# EAGLE schematic Board2 (EAGLE 9.6.2)
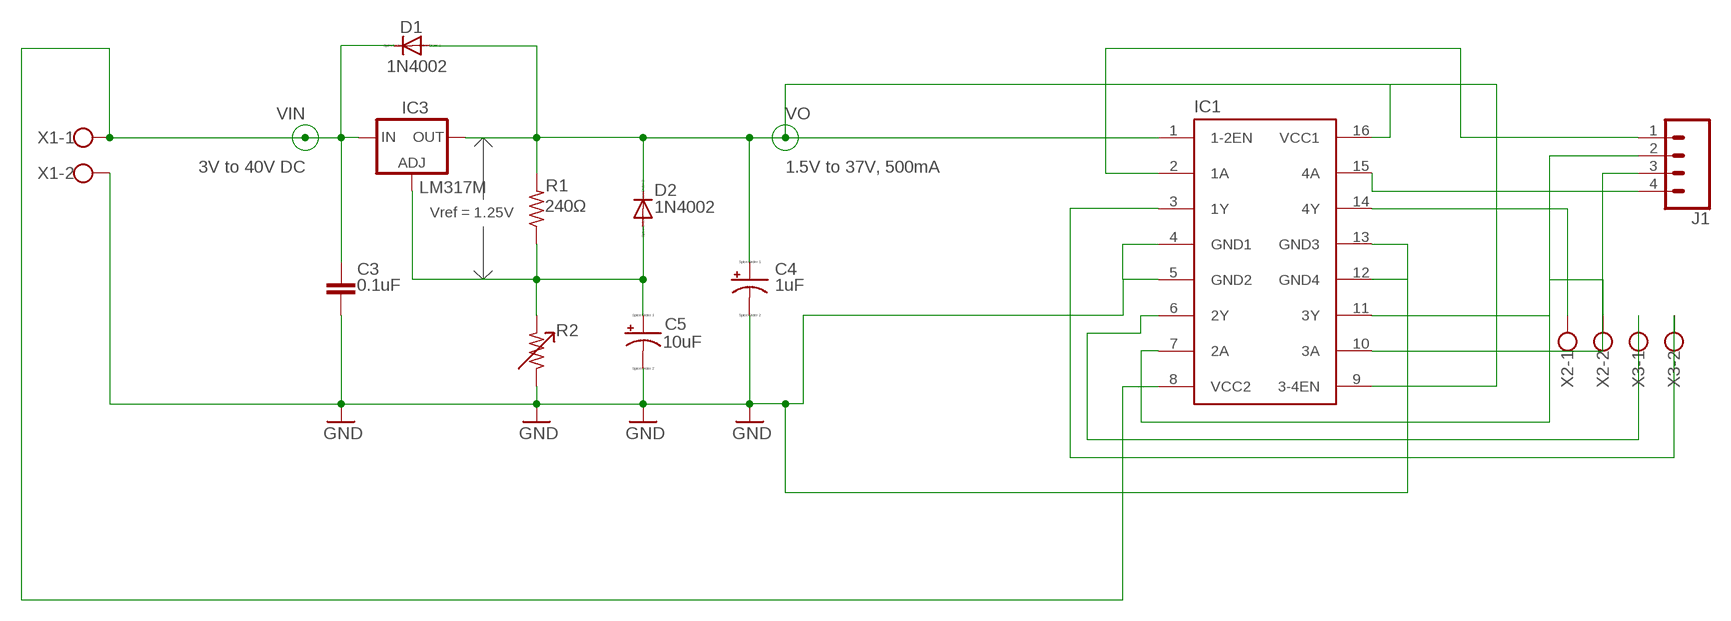
[diagram p0: schematic, sheet 1]

## Parts
C3  0.1uF  C-EU075-052X106  [C075-052X106]
C4  1uF  CPOL-US085CS-1AR  [085CS_1AR]
C5  10uF  CPOL-US085CS-1AR  [085CS_1AR]
D1  1N4002  1N4004  [DO41-10]
D2  1N4002  1N4004  [DO41-10]
IC1  L293D  [DIL16]
IC3  LM317MBSTT3  [SOT223]
J1  CONN_04PTH  [1X04]
R1  240Ω  R-US_M0805  [M0805]
R2  RESISTOR_TRIMR0805  [R0805]
X1  W237-102  [W237-102]
X2  W237-102  [W237-102]
X3  W237-102  [W237-102]

## Nets
GND: C3.2 C4.- C5.- IC1.4(GND1) IC1.5(GND2) IC1.12(GND4) IC1.13(GND3) R2.1 X1.2
N$1: C5.+ D2.A IC3.1(ADJ) R1.1 R2.2
N$2: IC1.15(4A) J1.4
N$3: IC1.10(3A) J1.3
N$4: IC1.14(4Y) X2.1
N$5: IC1.11(3Y) X2.2
N$6: IC1.3(1Y) X3.2
N$7: IC1.6(2Y) X3.1
N$8: IC1.7(2A) J1.2
N$9: IC1.2(1A) J1.1
VIN: C3.1 D1.C IC1.8(VCC2) IC3.3(IN) X1.1
VO: C4.+ D1.A D2.C IC1.1(1-2EN) IC1.9(3-4EN) IC1.16(VCC1) IC3.4(OUT) R1.2

## Notes on the sheet
- 3V to 40V DC | 1.5V to 37V, 500mA
- Vref = 1.25V

## Library data of the parts
C3 = rcl:C-EU: CAPACITOR, European symbol
C4 C5 = resistor:CPOL-US: POLARIZED CAPACITOR, American symbol
D1 D2 = diode:1N4004: DIODE general purpose rectifier, 1 A
IC1 = st-microelectronics:L293D: PUSH-PULL 4 CHANNEL DRIVER; MPN: L293D; OC_FARNELL: 9589619; OC_NEWARK: 56P8249
IC3 = v-reg:LM317?*: 500 mA Adjustable Output Positive Voltage Regulator Source: http://www.onsemi.co.jp .. LM317M-D.PDF; PARTNUMBER: LM317M
J1 = SparkFun-Connectors:CONN_04: Multi connection point. Often used as Generic Header-pin footprint for 0.1 inch spaced/style header connections On any of the 0.1 inch spaced packages, you can populate with these: Break Away Headers - Straight <https://www.sparkfun.com/products/116> (PRT-00116) Break Away Male Headers - Right Angle <https://www.sparkfun.com/products/553> (PRT-00553) Female Headers <https://www.sparkfun.com/products/115> (PRT-00115) Break Away Headers - Machine Pin <https://www.sparkfun.com/products/117> (PRT-00117) Break Away Female Headers - Swiss Machine Pin <https://www.sparkfun.com/products/743> (PRT-00743) For SCREWTERMINALS and SPRING TERMINALS visit here: Screw Terimnals on SparkFun.com <https://www.sparkfun.com/search/results?term=Screw+Terminals> (5mm/3.5mm/2.54mm spacing) This device is also useful as a general connection point to wire up your design to another part of your project. Our various solder wires solder well into these plated through hole pads. Hook-Up Wire - Assortment (Stranded, 22 AWG) <https://www.sparkfun.com/products/11375> (PRT-11375) Hook-Up Wire - Assortment (Solid Core, 22 AWG) <https://www.sparkfun.com/products/11367> (PRT-11367) View the entire wire category on our website here <https://www.sparkfun.com/categories/141> Special notes: Molex polarized connector foot print use with SKU : PRT-08231 with associated crimp pins and housings. 1MM SMD Version SKU: PRT-10208; PROD_ID: CONN-09696
R1 = resistor:R-US_: RESISTOR, American symbol
R2 = designblock:RESISTOR_TRIM: RESISTOR, American symbol
X1-X3 = con-wago-500:W237-102: WAGO SCREW CLAMP; MPN: 237-102; OC_FARNELL: unknown; OC_NEWARK: 70K9898